# Altium schematic sheet LDO_Slow.SchDoc
size 420 x 297 mm; Address1: Address1; Address2: Address2; Address3: Address3; Address4: Address4; SheetNumber: 1; Scale: 1:1; Разраб.: Иванов; Обозначение документа: АБВГ.123456.001 Э3; Пров.: Петров; Утв.: Сидоров; Наименование организации: ОАО "Концерн "МПО-Гидроприбор"; Перв. применение: АБВГ.123456.000; Наименование изделия 1: Плата; Наименование изделия 2: Схема электрическая; Наименование изделия 3: принципиальная; Нач. отд.: Нач. отд.; Фамилия нач. отд.: Сидоров
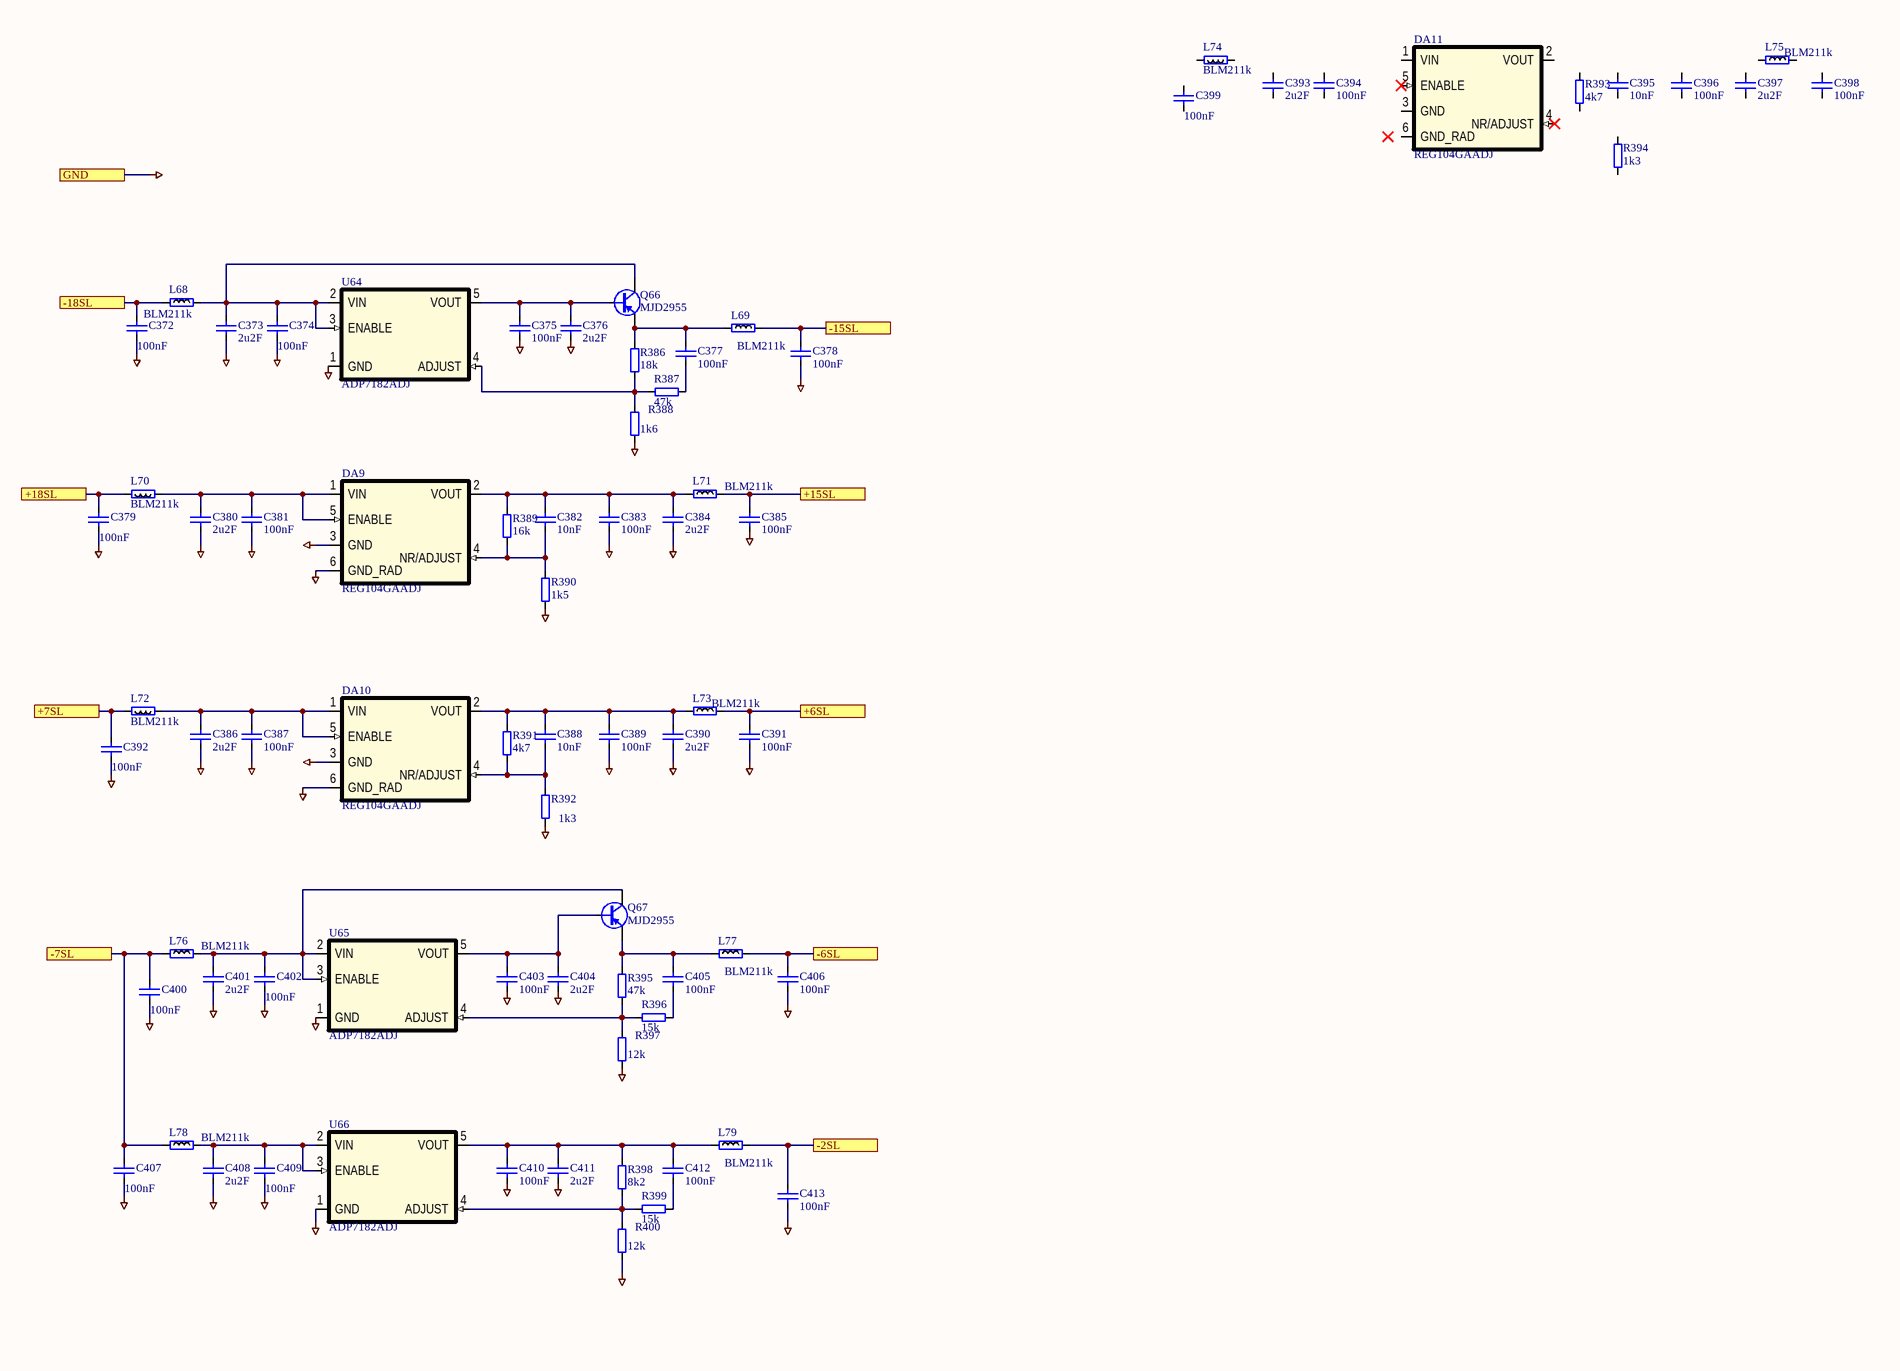
[diagram p0: LDO_Slow.SchDoc, right]

## Parts
C372  100nF  [SMD0805CAP]
C373  2u2F  [SMD0805CAP]
C374  100nF  [SMD0805CAP]
C375  100nF  [SMD0805CAP]
C376  2u2F  [SMD0805CAP]
C377  100nF  [SMD0805CAP]
C378  100nF  [SMD0805CAP]
C379  100nF  [SMD0805CAP]
C380  2u2F  [SMD0805CAP]
C381  100nF  [SMD0805CAP]
C382  10nF  [SMD0805CAP]
C383  100nF  [SMD0805CAP]
C384  2u2F  [SMD0805CAP]
C385  100nF  [SMD0805CAP]
C386  2u2F  [SMD0805CAP]
C387  100nF  [SMD0805CAP]
C388  10nF  [SMD0805CAP]
C389  100nF  [SMD0805CAP]
C390  2u2F  [SMD0805CAP]
C391  100nF  [SMD0805CAP]
C392  100nF  [SMD0805CAP]
C393  2u2F  [SMD0805CAP]
C394  100nF  [SMD0805CAP]
C395  10nF  [SMD0805CAP]
C396  100nF  [SMD0805CAP]
C397  2u2F  [SMD0805CAP]
C398  100nF  [SMD0805CAP]
C399  100nF  [SMD0805CAP]
C400  100nF  [SMD0805CAP]
C401  2u2F  [SMD0805CAP]
C402  100nF  [SMD0805CAP]
C403  100nF  [SMD0805CAP]
C404  2u2F  [SMD0805CAP]
C405  100nF  [SMD0805CAP]
C406  100nF  [SMD0805CAP]
C407  100nF  [SMD0805CAP]
C408  2u2F  [SMD0805CAP]
C409  100nF  [SMD0805CAP]
C410  100nF  [SMD0805CAP]
C411  2u2F  [SMD0805CAP]
C412  100nF  [SMD0805CAP]
C413  100nF  [SMD0805CAP]
DA9  REG104GAADJ  [SOT223_6-127]
DA10  REG104GAADJ  [SOT223_6-127]
DA11  REG104GAADJ  [SOT223_6-127]
L68  BLM211k  [RESC2012X50N]
L69  BLM211k  [RESC2012X50N]
L70  BLM211k  [RESC2012X50N]
L71  BLM211k  [RESC2012X50N]
L72  BLM211k  [RESC2012X50N]
L73  BLM211k  [RESC2012X50N]
L74  BLM211k  [RESC2012X50N]
L75  BLM211k  [RESC2012X50N]
L76  BLM211k  [RESC2012X50N]
L77  BLM211k  [RESC2012X50N]
L78  BLM211k  [RESC2012X50N]
L79  BLM211k  [RESC2012X50N]
Q66  MJD2955  [DPAK]
Q67  MJD2955  [DPAK]
R386  18k  [SMD0805RES]
R387  47k  [SMD0805RES]
R388  1k6  [SMD0805RES]
R389  16k  [SMD0805RES]
R390  1k5  [SMD0805RES]
R391  4k7  [SMD0805RES]
R392  1k3  [SMD0805RES]
R393  4k7  [SMD0805RES]
R394  1k3  [SMD0805RES]
R395  47k  [SMD0805RES]
R396  15k  [SMD0805RES]
R397  12k  [SMD0805RES]
R398  8k2  [SMD0805RES]
R399  15k  [SMD0805RES]
R400  12k  [SMD0805RES]
U64  ADP7182ADJ  [SOT23-5]
U65  ADP7182ADJ  [SOT23-5]
U66  ADP7182ADJ  [SOT23-5]

## Ports
+6SL, +7SL, +15SL, +18SL, -2SL, -6SL, -7SL, -15SL, -18SL, GND

## Nets
GND: C372.2 C373.2 C374.2 C375.1 C376.1 C378.1 C379.2 C380.1 C381.1 C383.1 C384.1 C385.1 C386.1 C387.1 C389.1 C390.1 C391.1 C392.2 C400.2 C401.2 C402.2 C403.1 C404.1 C406.1 C407.2 C408.2 C409.2 C410.1 C411.1 C413.1 DA9.3(GND) DA9.6(GND_RAD) DA10.3(GND) DA10.6(GND_RAD) R388.1 R390.1 R392.1 R397.1 R400.1 U64.1(GND) U65.1(GND) U66.1(GND) ; port GND
+6SL: C391.2 L73.1 ; port +6SL
+7SL: C392.1 L72.1 ; port +7SL
+15SL: C385.2 L71.1 ; port +15SL
+18SL: C379.1 L70.1 ; port +18SL
-2SL: C413.2 L79.1 ; port -2SL
-6SL: C406.2 L77.1 ; port -6SL
-7SL: C400.1 C407.1 L76.2 L78.2 ; port -7SL
-15SL: C378.2 L69.1 ; port -15SL
-18SL: C372.1 L68.2 ; port -18SL
NetC373_1: C373.1 C374.1 L68.1 Q66.3(C) U64.2(VIN) U64.3(ENABLE)
NetC375_2: C375.2 C376.2 Q66.1(B) U64.5(VOUT)
NetC377_1: C377.1 R387.1
NetC377_2: C377.2 L69.2 Q66.2(E) R386.2
NetC380_2: C380.2 C381.2 DA9.1(VIN) DA9.5(ENABLE) L70.2
NetC382_1: C382.1 DA9.4(NR/ADJUST) R389.1 R390.2
NetC382_2: C382.2 C383.2 C384.2 DA9.2(VOUT) L71.2 R389.2
NetC386_2: C386.2 C387.2 DA10.1(VIN) DA10.5(ENABLE) L72.2
NetC388_1: C388.1 DA10.4(NR/ADJUST) R391.1 R392.2
NetC388_2: C388.2 C389.2 C390.2 DA10.2(VOUT) L73.2 R391.2
NetC401_1: C401.1 C402.1 L76.1 Q67.3(C) U65.2(VIN) U65.3(ENABLE)
NetC403_2: C403.2 C404.2 Q67.1(B) U65.5(VOUT)
NetC405_1: C405.1 R396.1
NetC405_2: C405.2 L77.2 Q67.2(E) R395.2
NetC408_1: C408.1 C409.1 L78.1 U66.2(VIN) U66.3(ENABLE)
NetC410_2: C410.2 C411.2 C412.2 L79.2 R398.2 U66.5(VOUT)
NetC412_1: C412.1 R399.1
NetR386_1: R386.1 R387.2 R388.2 U64.4(ADJUST)
NetR395_1: R395.1 R396.2 R397.2 U65.4(ADJUST)
NetR398_1: R398.1 R399.2 R400.2 U66.4(ADJUST)

Not connected (* = marked no-connect by the designer): C393 1 2; C394 1 2; C395 1 2; C396 1 2; C397 1 2; C398 1 2; C399 1 2; DA11 1(VIN) 2(VOUT) 3(GND) 4(NR/ADJUST)* 5(ENABLE)* 6(GND_RAD); L74 1 2; L75 1 2; R393 1 2; R394 1 2

## Notes on the sheet
- Подп. и дата
- Инв. № дубл.
- Взам. инв. №
- Инв. № подл.
- Изм.
- Лист
- № докум.
- Подп.
- Дата
- Копировал
- Формат А3

## Library data of the parts
C372-C413 = C0805: Чип конденсатор 0805; Voltage: 25V; Vendor: Vishay; DielectricType: X5R; SMD Solders: 2; Solder Option: RM; Tolerance: 20%; Pkg: SMD0805; Device: Cap0805; Price: 2
  C372 C374 C375 C377-C379 C381 C383 C385 C387 C389 C391 C392 C394 C396 C398-C400 C402 C403 C405-C407 C409 C410 C412 C413: Value: 100nF
  C373 C376 C380 C384 C386 C390 C393 C397 C401 C404 C408 C411: Value: 2u2F
  C382 C388 C395: Value: 10nF
DA9-DA11 = REG104GA: Positive LDO Linear stabilizer; Vendor: Texas Instruments; Value: ADJ; SMD Solders: 6; Solder Option: RM; TC: 70ppm/C; Tolerance: +-2% Max; Pkg: SOT223-6; Name to order: REG104GA-A; Vref: 1V295; Price: 1000; Device: REG104GA
L68 L70 L72 L74 L76 L78 = BLM21: SMD Ferrite bead 0805; Vendor: Vishay; Value: 1k; Pkg: SMD0805; SMD Solders: 2; Solder Option: RM; Price: 10; Device: BLM21
L69 L71 L73 L75 L77 L79 = BLM21: SMD Ferrite bead 0805; Vendor: Vishay; Value: 1k; Pkg: SMD0805; SMD Solders: 2; Solder Option: i; Price: 10; Device: BLM21
Q66 Q67 = MJD2955: PNP транзистор; Vendor: ON Semiconductor; SMD Solders: 3; Solder Option: RM; Name to order: MJD29G55; Voltage: -60V; Pkg: DPAK; Price: 100; Device: MJD2955
R386 R389 R391 R393 R395 R398 = R0805: Чип резистор 0805; Vendor: Vishay; SMD Solders: 2; Solder Option: RM; TC: 100ppm/C; Tolerance: 1%; Pkg: SMD0805; Pwr: 125mW; Device: Res0805; Price: 2
  R386: Value: 18k
  R389: Value: 16k
  R391 R393: Value: 4k7
  R395: Value: 47k
  R398: Value: 8k2
R387 R388 R390 R392 R394 R396 R397 R399 R400 = R0805: Чип резистор 0805; Vendor: Vishay; SMD Solders: 2; Solder Option: ADJ; TC: 100ppm/C; Tolerance: 1%; Pkg: SMD0805; Pwr: 125mW; Device: Res0805; Price: 2
  R387: Value: 47k
  R388: Value: 1k6
  R390: Value: 1k5
  R392 R394: Value: 1k3
  R396 R399: Value: 15k
  R397 R400: Value: 12k
U64-U66 = ADP7182: Negative LDO Linear stabilizer; Vendor: Analog Devoces; Value: ADJ; SMD Solders: 5; Solder Option: RM; Name to order: ADP7182AUJZ-R7; Vref: 1V22; Pkg: SOT23-5; Price: 100; Device: ADP7182